# Altium schematic sheet BI7.SchDoc
size 420 x 297 mm; DocumentNumber: 12; SheetNumber: 12; SheetTotal: 13; DecimalNumber: СНАБ.468222.001 ЭЗ
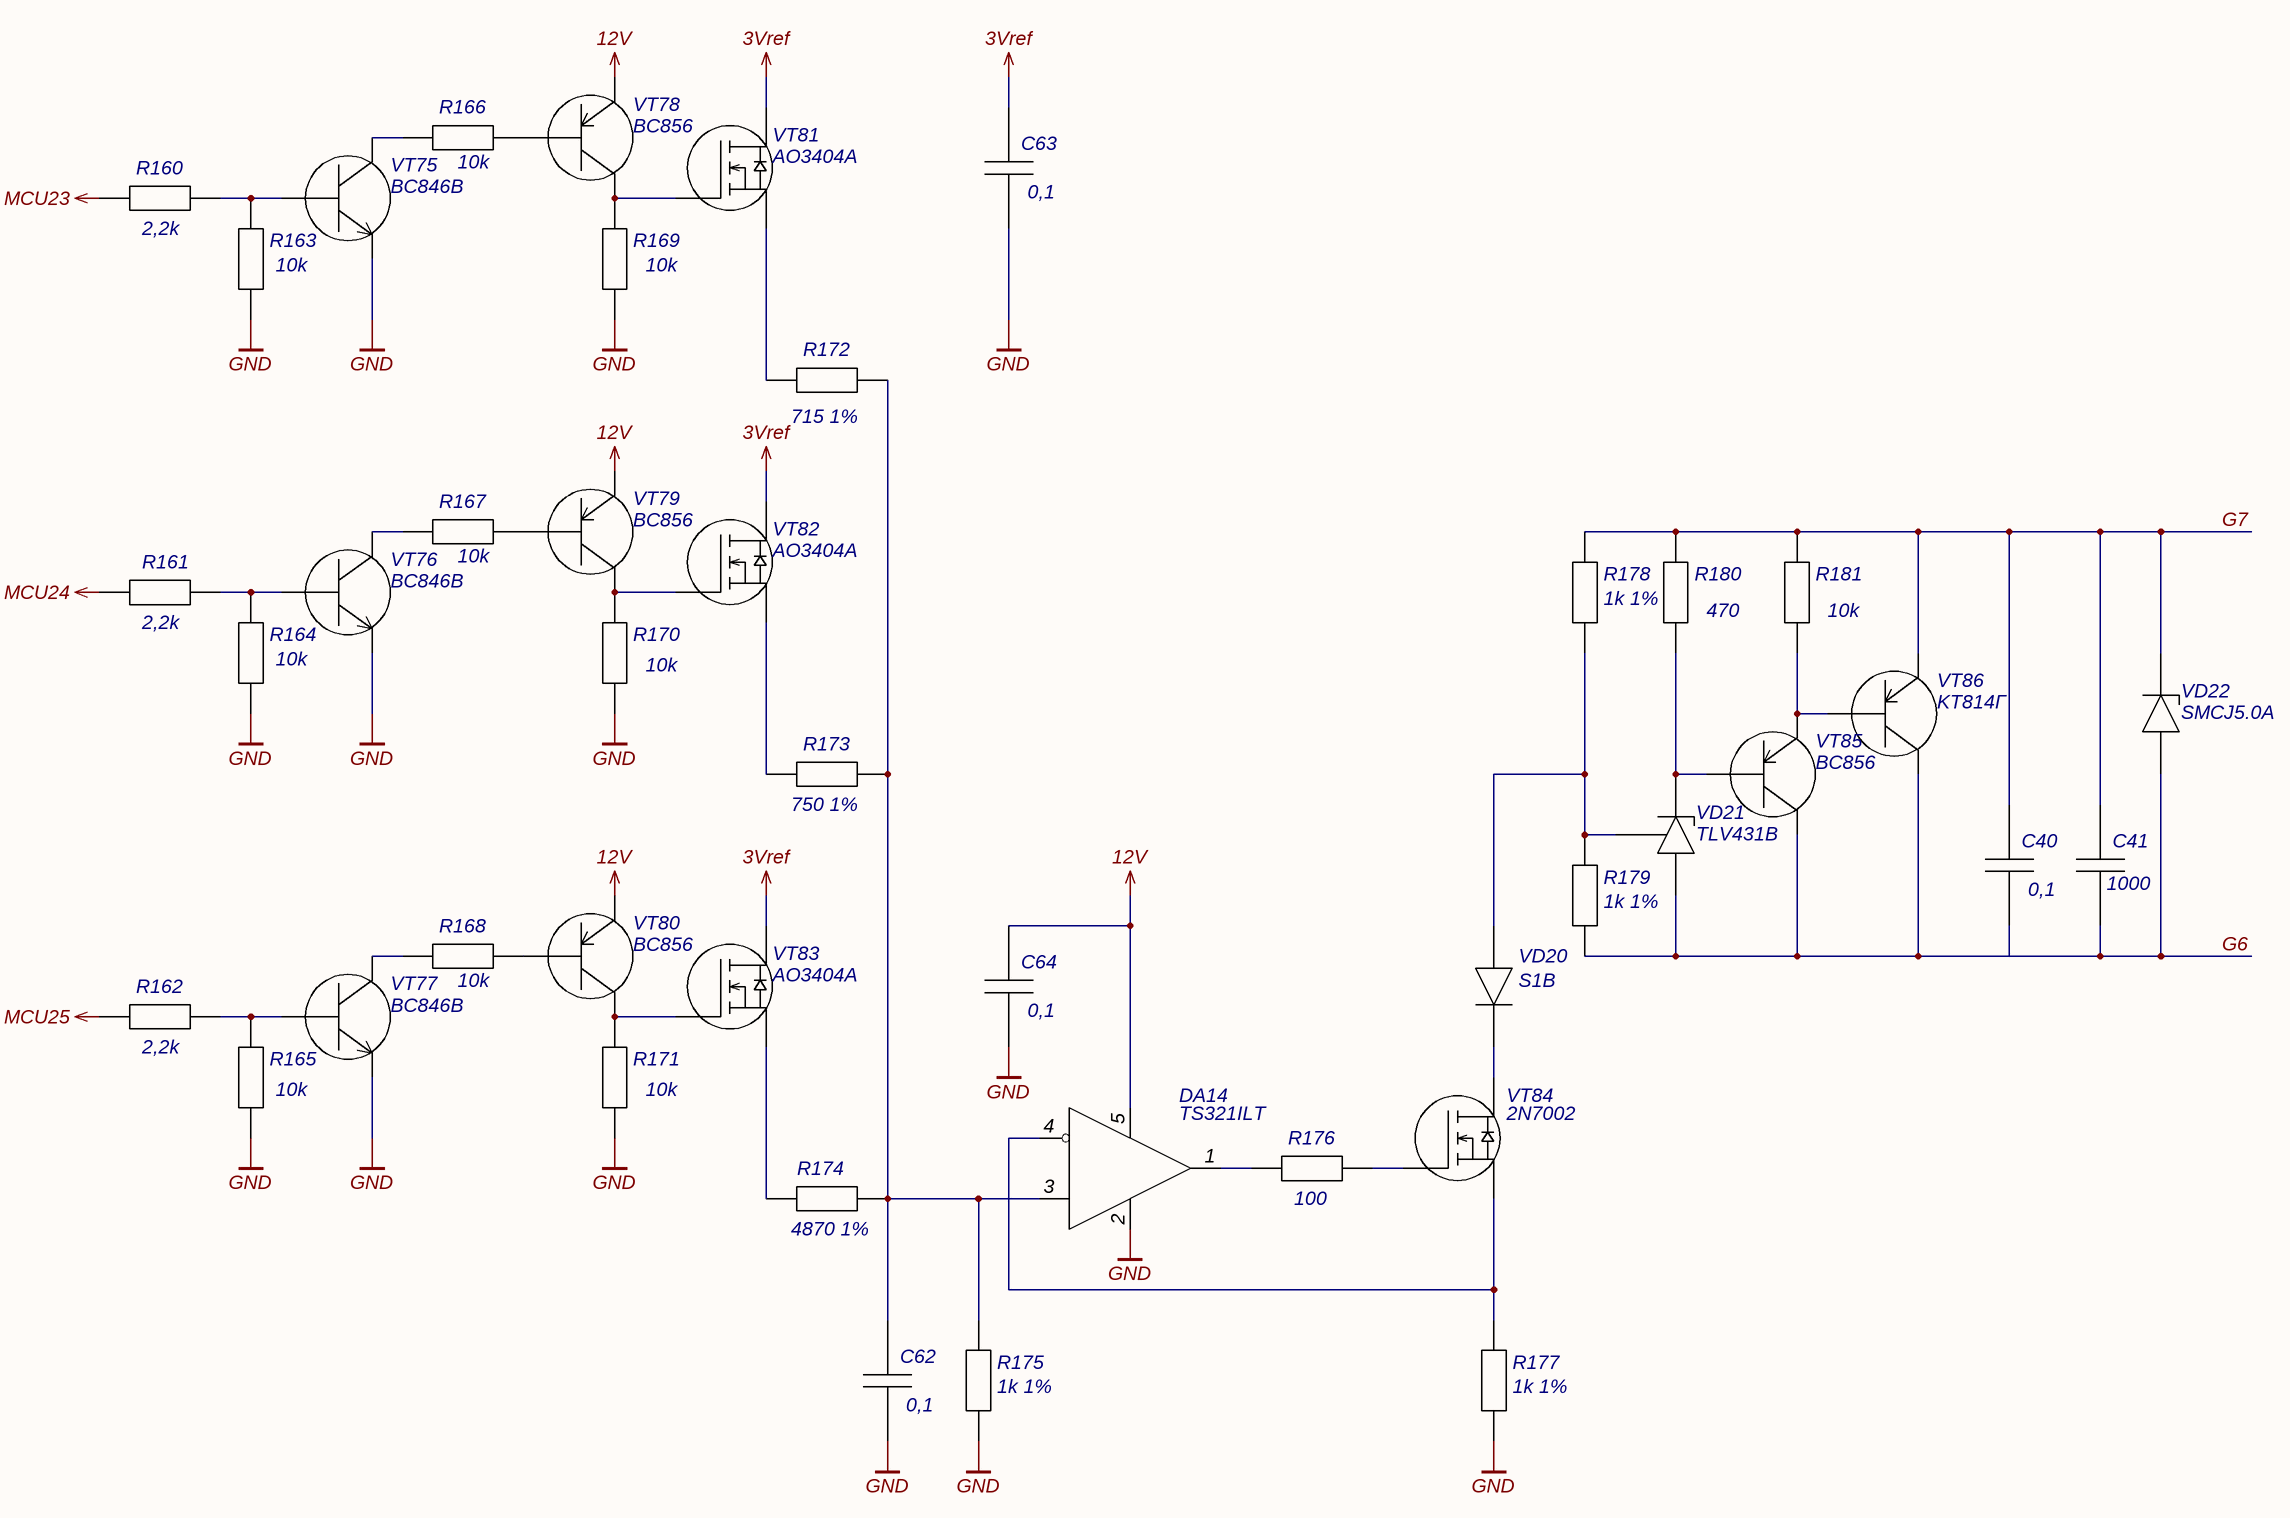
[diagram p0: BI7.SchDoc]

## Parts
C40  0,1  [C0603]
C41  1000  [C0603]
C62  0,1  [C0603]
C63  0,1  [C0603]
C64  0,1  [C0603]
DA14  TS321ILT  [SOT-23-5]
R160  2,2k  [R0603]
R161  2,2k  [R0603]
R162  2,2k  [R0603]
R163  10k  [R0603]
R164  10k  [R0603]
R165  10k  [R0603]
R166  10k  [R0603]
R167  10k  [R0603]
R168  10k  [R0603]
R169  10k  [R0603]
R170  10k  [R0603]
R171  10k  [R0603]
R172  715 1%  [R0603]
R173  750 1%  [R0603]
R174  4870 1%  [R0603]
R175  1k 1%  [R0603]
R176  100  [R0603]
R177  1k 1%  [R0603]
R178  1k 1%  [R0603]
R179  1k 1%  [R0603]
R180  470  [R0603]
R181  10k  [R0603]
VD20  S1B  [DO-214AC]
VD21  TLV431B  [SOT-23]
VD22  SMCJ5.0A  [DO-214AB]
VT75  BC846B  [SOT-23]
VT76  BC846B  [SOT-23]
VT77  BC846B  [SOT-23]
VT78  BC856  [SOT-23]
VT79  BC856  [SOT-23]
VT80  BC856  [SOT-23]
VT81  AO3404A  [SOT-23]
VT82  AO3404A  [SOT-23]
VT83  AO3404A  [SOT-23]
VT84  2N7002  [SOT-23]
VT85  BC856  [SOT-23]
VT86  KT814Г  [TO-126]

## Nets
3Vref: C63.2 VT81.2(D) VT82.2(D) VT83.2(D)
12V: C64.2 DA14.5(Vcc) VT78.1 VT79.1 VT80.1
GND: C62.1 C63.1 C64.1 DA14.2(GND) R163.1 R164.1 R165.1 R169.1 R170.1 R171.1 R175.1 R177.1 VT75.2(E) VT76.2(E) VT77.2(E)
MCU23: R160.1
MCU24: R161.1
MCU25: R162.1
G6: C40.1 C41.1 R179.1 VD21.1 VD22.1 VT85.2 VT86.2
G7: C40.2 C41.2 R178.2 R180.2 R181.2 VD22.2 VT86.1
NetC62_2: C62.2 DA14.3(+) R172.2 R173.2 R174.2 R175.2
NetDA14_1: DA14.1(OUT) R176.1
NetDA14_4: DA14.4(-) R177.2 VT84.3(S)
NetR160_2: R160.2 R163.2 VT75.1(B)
NetR161_2: R161.2 R164.2 VT76.1(B)
NetR162_2: R162.2 R165.2 VT77.1(B)
NetR166_1: R166.1 VT75.3(C)
NetR166_2: R166.2 VT78.3
NetR167_1: R167.1 VT76.3(C)
NetR167_2: R167.2 VT79.3
NetR168_1: R168.1 VT77.3(C)
NetR168_2: R168.2 VT80.3
NetR169_2: R169.2 VT78.2 VT81.1(G)
NetR170_2: R170.2 VT79.2 VT82.1(G)
NetR171_2: R171.2 VT80.2 VT83.1(G)
NetR172_1: R172.1 VT81.3(S)
NetR173_1: R173.1 VT82.3(S)
NetR174_1: R174.1 VT83.3(S)
NetR176_2: R176.2 VT84.1(G)
NetR178_1: R178.1 R179.2 VD20.1 VD21.3
NetR180_1: R180.1 VD21.2 VT85.3
NetR181_1: R181.1 VT85.1 VT86.3
NetVD20_2: VD20.2 VT84.2(D)

## Notes on the sheet
- Подп. и дата
- Инв.№ дубл.
- Взам.инв.№
- Подп.и дата
- Инв.№ подл.
- Изм.
- Лист
- № докум.
- Подп.
- Дата
- Копировал
- Формат  A3

## Library data of the parts
C40 C41 C62-C64 = Chip Capasitor: Чип-конденсатор
  C40 C62-C64: Value: 0,1
  C41: Value: 1000
DA14 = TS321ILT: 1х Операционный усилитель; Manufacurer: STMicroelectronics; Case: SOT-23-5; Name: TS321ILT; Datasheet: https://static.chipdip.ru/lib/710/DOC011710227.pdf
R160-R171 R176 R180 R181 = Chip Resistor: Чип-резистор
  R160-R162: Value: 2,2k
  R163-R171 R181: Value: 10k
  R176: Value: 100
  R180: Value: 470
R172 = Chip Resistor: Чип-резистор; Partnumber: RC0603FR-07715RL; Value: 715 1%; URL: https://www.chipdip.ru/product0/8002000768
R173 = Chip Resistor: Чип-резистор; Partnumber: RC0603FR-07750RL; Value: 750 1%; URL: https://www.chipdip.ru/product/0.1w-0603-750-om-1
R174 = Chip Resistor: Чип-резистор; Partnumber: RC0603FR-074K87L; Value: 4870 1%; URL: https://www.chipdip.ru/product0/8002000679
R175 R177-R179 = Chip Resistor: Чип-резистор; Partnumber: CRCW06031K00FKEAC; Value: 1k 1%; URL: https://www.chipdip.ru/product0/8002019285
VD20 = S1B: Диод выпрямительный, 100В; Manufacturer: Diotec Semiconductor; Case: DO-214AC; Name: S1B; Datasheet: https://static.chipdip.ru/lib/113/DOC032113174.pdf
VD21 = TLV431B: Стабилитрон регулируемый, 6В; Manufacturer: Texas Instruments; Case: SOT-23; Name: TLV431B; Datasheet: https://static.chipdip.ru/lib/985/DOC012985043.pdf
VD22 = SMCJ5.0A: Защитный диод, 5В; Manufacturer: UTD Semiconductor Co.,Ltd; Case: DO-201; Name: SMCJ5.0A; Datasheet: https://static.chipdip.ru/lib/863/DOC025863760.pdf
VT75-VT77 = BC846B: Транзистор биполярный NPN, 65В; Manufacturer: Nexperia B.V.; Case: SOT-23; Name: BC846B; Datasheet: https://static.chipdip.ru/lib/551/DOC012551042.pdf
VT78-VT80 VT85 = BC856: Транзистор биполярный PNP, 65В; Manufacturer: Nexperia; Case: SOT-23; Name: BC856; Datasheet: https://static.chipdip.ru/lib/365/DOC004365998.pdf
VT81-VT83 = AO3404A: Транзистор MOSFET N-канал, 30В; Manufacturer: UTD Semiconductor Co.,Ltd; Case: SOT-23; Name: AO3404A; Datasheet: https://static.chipdip.ru/lib/906/DOC012906979.pdf
VT84 = 2N7002: Транзистор MOSFET N-канал, 60В; Manufacturer: UTD Semiconductor Co.; Case: SOT-23; Name: 2N7002; Datasheet: https://static.chipdip.ru/lib/301/DOC021301072.pdf
VT86 = KT814Г: Транзистор биполярный PNP, 100В; Manufacturer: АО «ГРУППА КРЕМНИЙ ЭЛ»; TU: аАО.336.184 ТУ/02; Case: TO-126; Name: KT814Г; Datasheet: https://static.chipdip.ru/lib/404/DOC047404057.pdf